# Altium project Universal Robot Board.PrjPcb
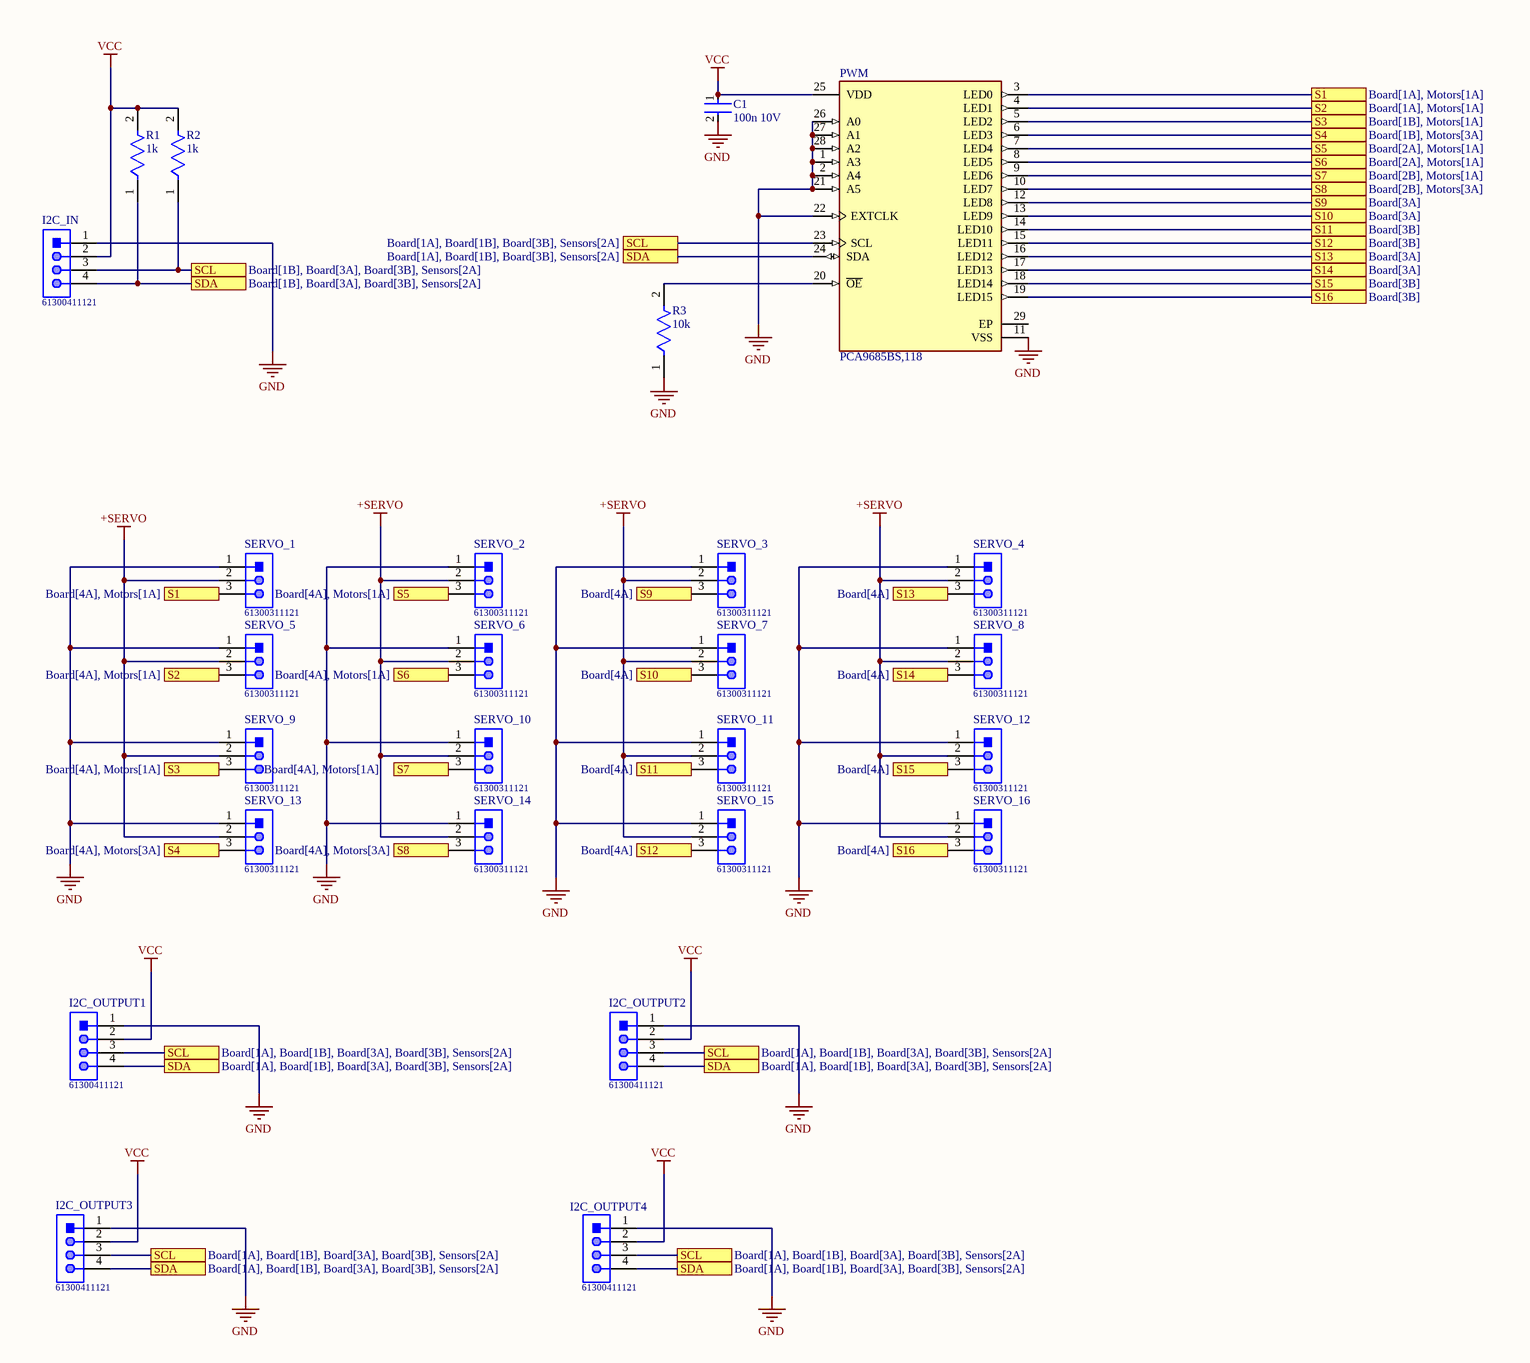
[diagram p0: Board.SchDoc]
4 sheets, 84 parts. Net scope: flat (ports and power ports of the same name join across sheets).
Board file: Board.PcbDoc
Sheets:
  Board.SchDoc
  Power.SchDoc
  Motors.SchDoc
  Sensors.SchDoc

## Sheet Board.SchDoc
size A1; SheetNumber: 1; SheetTotal: 4

### Parts
C1  100n 10V  [FP-GRM155-0_05-MFG]
I2C_IN  61300411121  [61300411121]
I2C_OUTPUT1  61300411121  [61300411121]
I2C_OUTPUT2  61300411121  [61300411121]
I2C_OUTPUT3  61300411121  [61300411121]
I2C_OUTPUT4  61300411121  [61300411121]
PWM  PCA9685BS,118  [FP-SOT788-1-IPC_B]
R1  1k  [FP-CRCW0402-e3-IPC_C]
R2  1k  [FP-CRCW0402-e3-IPC_C]
R3  10k  [FP-CRCW0402-e3-IPC_C]
SERVO_1  61300311121  [61300311121]
SERVO_2  61300311121  [61300311121]
SERVO_3  61300311121  [61300311121]
SERVO_4  61300311121  [61300311121]
SERVO_5  61300311121  [61300311121]
SERVO_6  61300311121  [61300311121]
SERVO_7  61300311121  [61300311121]
SERVO_8  61300311121  [61300311121]
SERVO_9  61300311121  [61300311121]
SERVO_10  61300311121  [61300311121]
SERVO_11  61300311121  [61300311121]
SERVO_12  61300311121  [61300311121]
SERVO_13  61300311121  [61300311121]
SERVO_14  61300311121  [61300311121]
SERVO_15  61300311121  [61300311121]
SERVO_16  61300311121  [61300311121]

### Ports
S1 (see Board[1A], Motors[1A]), S1 (see Board[4A], Motors[1A]), S2 (see Board[1A], Motors[1A]), S2 (see Board[4A], Motors[1A]), S3 (see Board[1B], Motors[1A]), S3 (see Board[4A], Motors[1A]), S4 (see Board[1B], Motors[3A]), S4 (see Board[4A], Motors[3A]), S5 (see Board[2A], Motors[1A]), S5 (see Board[4A], Motors[1A]), S6 (see Board[2A], Motors[1A]), S6 (see Board[4A], Motors[1A]), S7 (see Board[2B], Motors[1A]), S7 (see Board[4A], Motors[1A]), S8 (see Board[2B], Motors[3A]), S8 (see Board[4A], Motors[3A]), S9 (see Board[3A]), S9 (see Board[4A]), S10 (see Board[3A]), S10 (see Board[4A]), S11 (see Board[3B]), S11 (see Board[4A]), S12 (see Board[3B]), S12 (see Board[4A]), S13 (see Board[3A]), S13 (see Board[4A]), S14 (see Board[3A]), S14 (see Board[4A]), S15 (see Board[3B]), S15 (see Board[4A]), S16 (see Board[3B]), S16 (see Board[4A]), SCL (see Board[1A], Board[1B], Board[3A], Board[3B], Sensors[2A]), SCL (see Board[1A], Board[1B], Board[3B], Sensors[2A]), SCL (see Board[1B], Board[3A], Board[3B], Sensors[2A]), SDA (see Board[1A], Board[1B], Board[3A], Board[3B], Sensors[2A]), SDA (see Board[1A], Board[1B], Board[3B], Sensors[2A]), SDA (see Board[1B], Board[3A], Board[3B], Sensors[2A])

### Nets
+SERVO: SERVO_1.2 SERVO_2.2 SERVO_3.2 SERVO_4.2 SERVO_5.2 SERVO_6.2 SERVO_7.2 SERVO_8.2 SERVO_9.2 SERVO_10.2 SERVO_11.2 SERVO_12.2 SERVO_13.2 SERVO_14.2 SERVO_15.2 SERVO_16.2
GND: C1.2 I2C_IN.1 I2C_OUTPUT1.1 I2C_OUTPUT2.1 I2C_OUTPUT3.1 I2C_OUTPUT4.1 PWM.1(A3) PWM.2(A4) PWM.11(VSS) PWM.21(A5) PWM.22(EXTCLK) PWM.26(A0) PWM.27(A1) PWM.28(A2) R3.1 SERVO_1.1 SERVO_2.1 SERVO_3.1 SERVO_4.1 SERVO_5.1 SERVO_6.1 SERVO_7.1 SERVO_8.1 SERVO_9.1 SERVO_10.1 SERVO_11.1 SERVO_12.1 SERVO_13.1 SERVO_14.1 SERVO_15.1 SERVO_16.1
VCC: C1.1 I2C_IN.2 I2C_OUTPUT1.2 I2C_OUTPUT2.2 I2C_OUTPUT3.2 I2C_OUTPUT4.2 PWM.25(VDD) R1.2 R2.2
NetI2C_IN_3: I2C_IN.3 I2C_OUTPUT1.3 I2C_OUTPUT2.3 I2C_OUTPUT3.3 I2C_OUTPUT4.3 PWM.23(SCL) R2.1 ; port SCL
NetI2C_IN_4: I2C_IN.4 I2C_OUTPUT1.4 I2C_OUTPUT2.4 I2C_OUTPUT3.4 I2C_OUTPUT4.4 PWM.24(SDA) R1.1 ; port SDA
NetMOTOR_A1_1: PWM.7(LED4) SERVO_2.3 ; port S5
NetMOTOR_A1_2: PWM.8(LED5) SERVO_6.3 ; port S6
NetMOTOR_A1_3: PWM.9(LED6) SERVO_10.3 ; port S7
NetMOTOR_A1_16: PWM.10(LED7) SERVO_14.3 ; port S8
NetMOTOR_B1_1: PWM.4(LED1) SERVO_5.3 ; port S2
NetMOTOR_B1_2: PWM.5(LED2) SERVO_9.3 ; port S3
NetMOTOR_B1_3: PWM.6(LED3) SERVO_13.3 ; port S4
NetMOTOR_B1_16: PWM.3(LED0) SERVO_1.3 ; port S1
NetPWM_12: PWM.12(LED8) SERVO_3.3 ; port S9
NetPWM_13: PWM.13(LED9) SERVO_7.3 ; port S10
NetPWM_14: PWM.14(LED10) SERVO_11.3 ; port S11
NetPWM_15: PWM.15(LED11) SERVO_15.3 ; port S12
NetPWM_16: PWM.16(LED12) SERVO_4.3 ; port S13
NetPWM_17: PWM.17(LED13) SERVO_8.3 ; port S14
NetPWM_18: PWM.18(LED14) SERVO_12.3 ; port S15
NetPWM_19: PWM.19(LED15) SERVO_16.3 ; port S16
NetPWM_20: PWM.20(~{OE}) R3.2

Not connected (* = marked no-connect by the designer): PWM 29(EP)

### Library data of the parts
C1 = CMP-2008-04345-2: Chip Multilayer Ceramic Capacitors for General Purpose, 0402, 390pF, C0G, 30ppm/°C, 5%, 50V; REACH SVHC: No SVHC; Case Code (Metric): 1005; Thickness: 0.022inch; Lead Free: Lead Free; Case/Package: 0402; Min Operating Temperature: -55°C; Mount: Surface Mount; Length: 1mm; Depth: 0.5mm; Package Quantity: 1; Tolerance: 5%; Case Code (Imperial): 0402; Temperature Coefficient: 30ppm/°C; Packaging: Tape and Reel; Voltage Rating (DC): 50V; Material: Ceramic; Voltage Rating: 50V; Max Operating Temperature: 125°C; Voltage: 50V; Radiation Hardening: No; Capacitance: 390pF; Termination: SMD/SMT; Height: 0.5mm; Dielectric: C0G; Width: 0.02inch
I2C_IN I2C_OUTPUT1-I2C_OUTPUT4 = CMP-1502-01064-1: THT Vertical Pin Header WR-PHD, Pitch 2.54 mm, Single Row, 4 pins; Manufacturer: Wurth Elektronik; Withstanding Voltage: 500VAC; Rated Current: 3A; Working Voltage: 250VAC; Pin Number: 4; Gender: Male; Contact Resistance: 20mOhm; Pitch: 2.54mm; Manufacturer URL: http://www.we-online.de; Operating Temperature: -40to105degC; Packaging: Bag; Mounting Technology: THT; Package Reference: 61300411121; Datasheet URL: https://katalog.we-online.de/em/datasheet/6130xx11121.pdf; Publisher: WurthElektronik; Part Number: 61300411121; Row Number: Single; Orientation: Vertical
PWM = CMP-1595-00001-4: IC LED DRVR LIN DIM 25MA 28HVQFN; Number of Outputs: 16; Output Voltage: 5.5V; Frequency: 50MHz; Min Operating Temperature: -40°C; Package Quantity: 4000; Case/Package: VQFN; Number of Pins: 28; Contact Plating: Gold; Radiation Hardening: No; RoHS Compliant: Yes; Packaging: Tape and Reel; Mount: Surface Mount; Max Operating Temperature: 85°C
R1-R3 = CMP-2002-08122-2: RES Thick Film, 0Ω, 0.063W, 0402; Tolerance: 5%; Max Power Dissipation: 63mW; Voltage Rating: 50V; Temperature Coefficient: 100ppm/°C; Resistance: 0mR; Contact Plating: Tin; Height: 0.35mm; Radiation Hardening: No; Features: Automotive AEC-Q200; Composition: Thick Film; Width: 0.5mm; Weight: 2.3E-05oz; Termination: SMD/SMT; Packaging: Tape and Reel; Mount: Surface Mount; Case Code (Metric): 1005; Military Standard: Not; Min Operating Temperature: -55°C; Number of Terminations: 2; Package Quantity: 1; Case Code (Imperial): 0402; Depth: 0.5mm; Max Operating Temperature: 155°C; Case/Package: 0402; Power Rating: 63mW; Lead Free: Lead Free; Voltage Rating (DC): 50V; Length: 1mm
SERVO_1-SERVO_16 = CMP-1502-01062-1: THT Vertical Pin Header WR-PHD, Pitch 2.54 mm, Single Row, 3 pins; Manufacturer: Wurth Elektronik; Withstanding Voltage: 500VAC; Working Voltage: 250VAC; Rated Current: 3A; Pitch: 2.54mm; Pin Number: 3; Gender: Male; Contact Resistance: 20mOhm; Package Reference: 61300311121; Manufacturer URL: http://www.we-online.de; Datasheet URL: https://katalog.we-online.de/em/datasheet/6130xx11121.pdf; Operating Temperature: -40to105degC; Part Number: 61300311121; Orientation: Vertical; Packaging: Bag; Row Number: Single; Mounting Technology: THT; Publisher: WurthElektronik

## Sheet Power.SchDoc
size A1; SheetNumber: 2; SheetTotal: 4
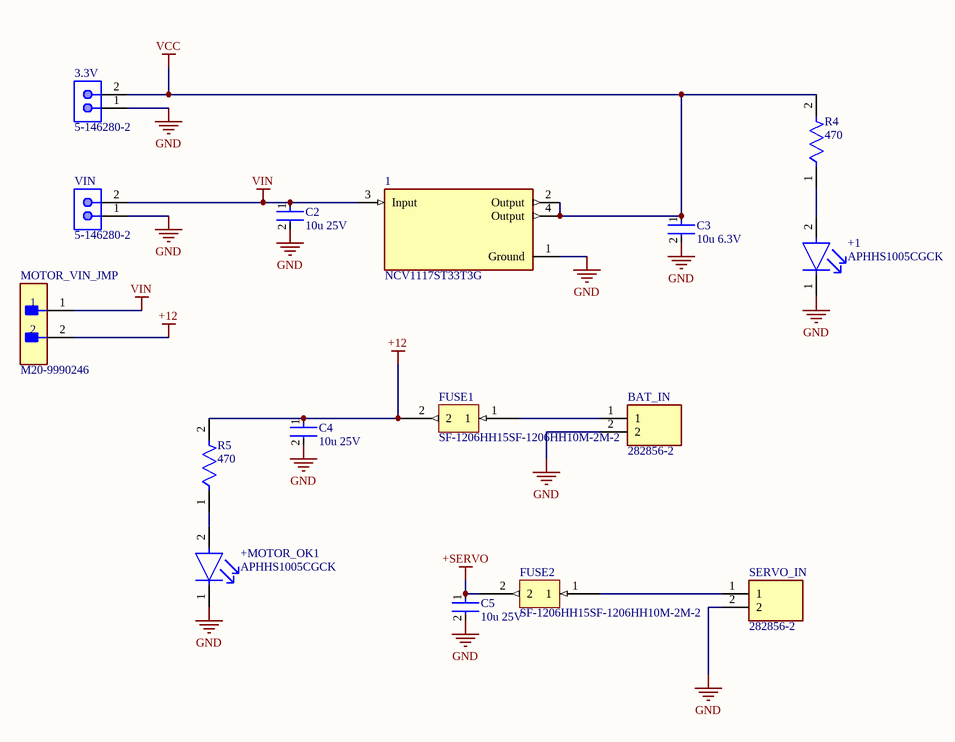
[diagram p1: Power.SchDoc]

### Parts
1  NCV1117ST33T3G  [FP-318H-MFG]
3.3V  5-146280-2  [TECO-5-146280-2_V]
+1  APHHS1005CGCK  [FP-APHHS1005CGCK-MFG]
+MOTOR_OK1  APHHS1005CGCK  [FP-APHHS1005CGCK-MFG]
BAT_IN  282856-2  [TE_282856-2]
C2  10u 25V  [FP-GRM21B-0_15-IPC_C]
C3  10u 6.3V  [FP-GRM155-0_05-MFG]
C4  10u 25V  [FP-GRM21B-0_15-IPC_C]
C5  10u 25V  [FP-GRM21B-0_15-IPC_C]
FUSE1  SF-1206HH15SF-1206HH10M-2M-2  [RESC3216X12N]
FUSE2  SF-1206HH15SF-1206HH10M-2M-2  [RESC3216X12N]
MOTOR_VIN_JMP  M20-9990246  [FP-M20-9990246-MFG]
R4  470  [FP-CRCW0402-e3-IPC_C]
R5  470  [FP-CRCW0402-e3-IPC_C]
SERVO_IN  282856-2  [TE_282856-2]
VIN  5-146280-2  [TECO-5-146280-2_V]

### Nets
+12: C4.1 FUSE1.2 MOTOR_VIN_JMP.2 R5.2
+SERVO: C5.1 FUSE2.2
GND: 1.1(Ground) 3.3V.1 +1.1(C) +MOTOR_OK1.1(C) BAT_IN.2 C2.2 C3.2 C4.2 C5.2 SERVO_IN.2 VIN.1
VCC: 1.2(Output) 1.4(Output) 3.3V.2 C3.1 R4.2
VIN: 1.3(Input) C2.1 MOTOR_VIN_JMP.1 VIN.2
Net+1_2: +1.2(A) R4.1
Net+MOTOR_OK1_2: +MOTOR_OK1.2(A) R5.1
NetBAT_IN_1: BAT_IN.1 FUSE1.1
NetFUSE2_1: FUSE2.1 SERVO_IN.1

### Library data of the parts
1 = CMP-07128-000021-1: IC REG LINEAR 3.3V 1A SOT223; Manufacturer: ON Semiconductor; Nominal Supply Current: 6mA; Min Supply Voltage: 2.4V; Number Of Outputs: 1; Standoff Height: 0.02mm; Automotive Grade: Grade 0; Accuracy Percentage: 1%; Max Junction Temp: +150°C; Output Type: Fixed; Dropout Voltage: 1.07V; Max Supply Voltage: 20V; Package: 318H; ComponentLink2Description: Datasheet; Output Current: 1A; Device Class L1: Integrated Circuits (ICs); Ambient Temperature Range Low: -40°C; Output Voltage: 3.3V; Octopart: https://octopart.com/ncv1117st33t3g-on+semiconductor-1215835; Manufacturer Part Number: NCV1117ST33T3G; Device Class L2: Power Management ICs; ComponentLink2URL: https://www.onsemi.com/pub/Collateral/NCP1117-D.PDF; Ipc Land Pattern Name: SOT230P700X180-4; Digikey Description: IC REG LINEAR 3.3V 1A SOT223; Height: 1.8mm; Ambient Temperature Range High: +125°C; Mouser Description: LDO Voltage Regulators 3.3V 1.0A Automotive; Category: IC; Temperature: -55°C to +150°C; Automotive: Yes; Temperature Range Low: -55°C; Temperature Range High: +150°C; Lead Free: Yes; Device Class L3: Voltage Regulators - Linear; RoHS: TRUE
3.3V VIN = CMP-2000-07492-1: Male Header, Pitch 2.54 mm, 1 x 2 Position, Height 8.21 mm, Tail Length 3.05 mm, -65 to 105 degC, RoHS, Bulk; Manufacturer: TE Connectivity; Mating Connector Lock: No(Without); Number of Positions: 2; Pitch: 2.54mm; PCB Mounting Orientation: Vertical; Keyed: No; Case\/Package: 100; Mating Post Length: 0.23inch; High Temperature Housing: Yes; Max Current Rating: 5A; PCB Thickness: 0.063inch; PCB Mount Retention: Without; Approvals: CSA; Current Rating: 3A; Radiation Hardening: No; Length: 4.67mm; Contact Mating Length: 0.23inch; Connector Type: Header; Number of Rows: 1; Termination Post Length: 0.12inch; Board Standoff: No(Without); Max Operating Temperature: 105degC; Contact Shape: Square; Selectively Loaded: No(Without); Gasket: No(Without); Number of Contacts: 2; Contact Gender: Male; Mating Alignment: No(Without); Manufacturer URL: http://www.te.com/; Datasheet URL: http://www.te.com/commerce/DocumentDelivery/DDEController?Action=showdoc&DocId=Customer+Drawing%7F146280%7FH1%7Fpdf%7FEnglish%7FENG_CD_146280_H1.pdf%7F5-146280-2; Mount: ThroughHole; Orientation: Straight; Packaging: Carton; Package Reference: 5-146280-2; Package Quantity: 500; Stabilizers: No(Without); Row Spacing: 2.54mm; Contact Material: CopperAlloy; Panel Mount Retention: No(Without); Datasheet Version: Rev. H1, 08/2016; Housing Colour: Black; Colour: Black; Package Description: Male Header, Pitch 2.54 mm, 1 x 2 Position, Height 8.21 mm, Tail Length 3.05 mm; Contact Plating: Matte; Housing Material: Polymer; Contact Protection: No(Without); Min Operating Temperature: -65degC; Mounting Technology: ThroughHole; Flammability Rating: UL94V-0; RoHSCompliant: true; Termination: ThroughHole; Depth: 2.34mm; High Speed Serial Data Connector: No
+1 +MOTOR_OK1 = CMP-44529-000044-1: LED GREEN CLEAR CHIP SMD; Viewing Angle: 120°; Dominant Wavelength: 570nm; Test Current: 20mA; Luminous Intensity: 50mcd; Forward Voltage: 2.1V; Number of LEDs: 1; Lens Color: Clear; Packaging: Tape and Reel; Max Operating Temperature: 85°C; Illumination Color: Green; Length: 1mm; Mount: Surface Mount; Lens Style: Clear; Color: Green; Number of Pins: 2; Wavelength: 570nm; Case/Package: 0402; Width: 0.5mm; Package Quantity: 2000; Case Code (Metric): 1005; Height: 0.6mm; Lead Free: Lead Free; Case Code (Imperial): 0402; Forward Current: 20mA; Min Operating Temperature: -40°C
BAT_IN SERVO_IN = CMP-036-000000-1: TERMI-BLOK PCB MOUNT 2P; MF: TE Connectivity; Design Item ID: 282856-2; Component Type: Standard; Package: None; Value: *; EU_RoHS_Compliance: Compliant with Exemptions; SnapEDA_Link: https://www.snapeda.com/parts/282856-2/TE%20Connectivity%20AMP%20Connectors/view-part/1809079/?ref=snap; Digi-Key_Purchase_URL: https://www.digikey.com/product-detail/en/te-connectivity-amp-connectors/1-282856-2/A98108-ND/1826971?utm_source=snapeda&utm_medium=aggregator&utm_campaign=symbol; Digi-Key_Part_Number: A98108-ND; TE_purchase_URL: https://www.te.com/usa-en/product-282856-2.html?te_bu=Cor&te_type=disp&te_campaign=seda_glo_cor-seda-global-disp-prtnr-fy19-seda-model-bom-cta_sma-317_1&elqCampaignId=32493; Pin Count: 2; MP: 282856-2; Source: SnapEDAsch.SchLib
C2 C4 C5 = CMP-2007-03541-2: Chip Multilayer Ceramic Capacitors for General Purpose, 0805, 10uF, X5R, 15%, 10%, 25V; Length: 2mm; Depth: 1.25mm; Termination: SMD/SMT; Voltage: 25V; Height: 1.25mm; Material: Ceramic; Thickness: 0.053inch; Radiation Hardening: No; Min Operating Temperature: -55°C; Width: 0.049inch; Package Quantity: 1; Mount: Surface Mount; Dielectric: X5R; Packaging: Tape and Reel; Capacitance: 10uF; Voltage Rating (DC): 25V; Lead Free: Lead Free; Max Operating Temperature: 85°C; Case Code (Imperial): 0805; Case/Package: 0805; Tolerance: 10%; Voltage Rating: 25V; Case Code (Metric): 2012
C3 = CMP-2008-04345-2: as C1 on sheet Board; REACH SVHC: No SVHC; Case Code (Metric): 1005; Thickness: 0.022inch; Lead Free: Lead Free; Case/Package: 0402; Min Operating Temperature: -55°C; Mount: Surface Mount; Length: 1mm; Depth: 0.5mm; Package Quantity: 1; Tolerance: 5%; Case Code (Imperial): 0402; Temperature Coefficient: 30ppm/°C; Packaging: Tape and Reel; Voltage Rating (DC): 50V; Material: Ceramic; Voltage Rating: 50V; Max Operating Temperature: 125°C; Voltage: 50V; Radiation Hardening: No; Capacitance: 390pF; Termination: SMD/SMT; Height: 0.5mm; Dielectric: C0G; Width: 0.02inch
FUSE1 FUSE2 = CMP-005-00013-1: Fuse Chip 10A 24VDC High Current and High Inrush Current Withstand 2-Pin SMD T/R
MOTOR_VIN_JMP = CMP-15831-000009-1: CONN HEADER VERT 2POS 2.54MM; Manufacturer: Harwin; Conn Gender: Male; Conn Orientation: Vertical; Number Of Contacts: 2; Current Rating: 3A; ComponentLink2URL: https://cdn.harwin.com/pdfs/M20-999.pdf; ComponentLink2Description: Datasheet; Package: M20-9990246; Temperature: -40°C to +105°C; Octopart: https://octopart.com/m20-9990246-harwin-2590635; Mouser Description: 2.54mm (0.1") Pitch SIL Vertical PC Tail Pin Header, 6.1mm mating pin height, tin, 2 contacts; Temperature Range High: +105°C; Device Class L1: Connectors; RoHS: TRUE; Automotive: No; Height: 8.99mm; Number Of Rows: 1; Contact Material: Tin,Nickel; Category: Conn; Pitch: 2.54mm; Lead Free: Yes; Digikey Description: CONN HEADER VERT 2POS 2.54MM; Manufacturer Part Number: M20-9990246; Temperature Range Low: -40°C; Device Class L3: unset; Device Class L2: Headers and Wire Housings
R4 R5 = CMP-2002-08122-2: as R1 on sheet Board; Contact Plating: Tin; Height: 0.35mm; Radiation Hardening: No; Features: Automotive AEC-Q200; Composition: Thick Film; Width: 0.5mm; Weight: 2.3E-05oz; Termination: SMD/SMT; Packaging: Tape and Reel; Mount: Surface Mount; Case Code (Metric): 1005; Military Standard: Not; Min Operating Temperature: -55°C; Number of Terminations: 2; Package Quantity: 1; Case Code (Imperial): 0402; Depth: 0.5mm; Max Operating Temperature: 155°C; Case/Package: 0402; Power Rating: 63mW; Lead Free: Lead Free; Voltage Rating (DC): 50V; Length: 1mm

## Sheet Motors.SchDoc
size A1; SheetNumber: 3; SheetTotal: 4
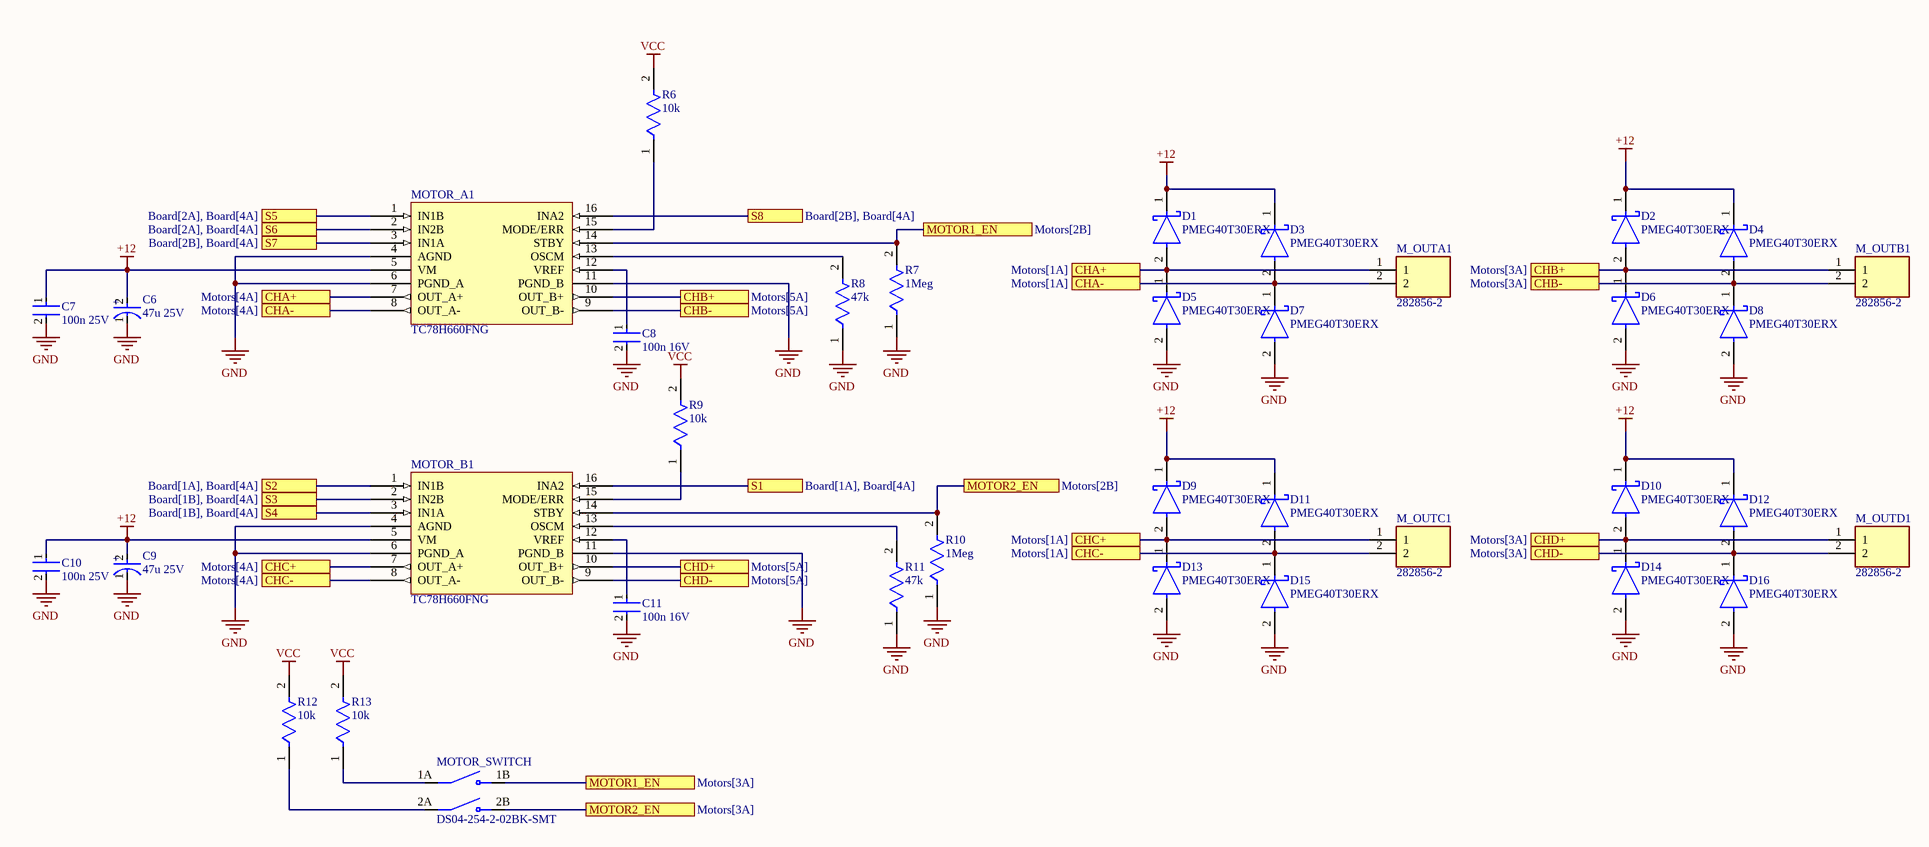
[diagram p2: Motors.SchDoc]

### Parts
C6  47u 25V  [FP-T491D476K025AT-MFG]
C7  100n 25V  [FP-C0402-BB-MFG]
C8  100n 16V  [FP-C0402-BB-MFG]
C9  47u 25V  [FP-T491D476K025AT-MFG]
C10  100n 25V  [FP-C0402-BB-MFG]
C11  100n 16V  [FP-C0402-BB-MFG]
D1  PMEG40T30ERX  [FP-SOD123-IPC_A]
D2  PMEG40T30ERX  [FP-SOD123-IPC_A]
D3  PMEG40T30ERX  [FP-SOD123-IPC_A]
D4  PMEG40T30ERX  [FP-SOD123-IPC_A]
D5  PMEG40T30ERX  [FP-SOD123-IPC_A]
D6  PMEG40T30ERX  [FP-SOD123-IPC_A]
D7  PMEG40T30ERX  [FP-SOD123-IPC_A]
D8  PMEG40T30ERX  [FP-SOD123-IPC_A]
D9  PMEG40T30ERX  [FP-SOD123-IPC_A]
D10  PMEG40T30ERX  [FP-SOD123-IPC_A]
D11  PMEG40T30ERX  [FP-SOD123-IPC_A]
D12  PMEG40T30ERX  [FP-SOD123-IPC_A]
D13  PMEG40T30ERX  [FP-SOD123-IPC_A]
D14  PMEG40T30ERX  [FP-SOD123-IPC_A]
D15  PMEG40T30ERX  [FP-SOD123-IPC_A]
D16  PMEG40T30ERX  [FP-SOD123-IPC_A]
M_OUTA1  282856-2  [TE_282856-2]
M_OUTB1  282856-2  [TE_282856-2]
M_OUTC1  282856-2  [TE_282856-2]
M_OUTD1  282856-2  [TE_282856-2]
MOTOR_A1  TC78H660FNG  [TSOP65P640X120-16N]
MOTOR_B1  TC78H660FNG  [TSOP65P640X120-16N]
MOTOR_SWITCH  DS04-254-2-02BK-SMT  [SW_DS04-254-2-02BK-SMT]
R6  10k  [FP-CRCW0402-e3-IPC_C]
R7  1Meg  [FP-CRCW0402-e3-IPC_C]
R8  47k  [FP-CRCW0402-e3-IPC_C]
R9  10k  [FP-CRCW0402-e3-IPC_C]
R10  1Meg  [FP-CRCW0402-e3-IPC_C]
R11  47k  [FP-CRCW0402-e3-IPC_C]
R12  10k  [FP-CRCW0402-e3-IPC_C]
R13  10k  [FP-CRCW0402-e3-IPC_C]

### Ports
CHA+ (see Motors[1A]), CHA+ (see Motors[4A]), CHA- (see Motors[1A]), CHA- (see Motors[4A]), CHB+ (see Motors[3A]), CHB+ (see Motors[5A]), CHB- (see Motors[3A]), CHB- (see Motors[5A]), CHC+ (see Motors[1A]), CHC+ (see Motors[4A]), CHC- (see Motors[1A]), CHC- (see Motors[4A]), CHD+ (see Motors[3A]), CHD+ (see Motors[5A]), CHD- (see Motors[3A]), CHD- (see Motors[5A]), MOTOR1_EN (see Motors[2B]), MOTOR1_EN (see Motors[3A]), MOTOR2_EN (see Motors[2B]), MOTOR2_EN (see Motors[3A]), S1 (see Board[1A], Board[4A]), S2 (see Board[1A], Board[4A]), S3 (see Board[1B], Board[4A]), S4 (see Board[1B], Board[4A]), S5 (see Board[2A], Board[4A]), S6 (see Board[2A], Board[4A]), S7 (see Board[2B], Board[4A]), S8 (see Board[2B], Board[4A])

### Nets
+12: C6.2(A) C7.1 C9.2(A) C10.1 D1.1(C) D2.1(C) D3.1(C) D4.1(C) D9.1(C) D10.1(C) D11.1(C) D12.1(C) MOTOR_A1.5(VM) MOTOR_B1.5(VM)
GND: C6.1(C) C7.2 C8.2 C9.1(C) C10.2 C11.2 D5.2(A) D6.2(A) D7.2(A) D8.2(A) D13.2(A) D14.2(A) D15.2(A) D16.2(A) MOTOR_A1.4(AGND) MOTOR_A1.6(PGND_A) MOTOR_A1.11(PGND_B) MOTOR_B1.4(AGND) MOTOR_B1.6(PGND_A) MOTOR_B1.11(PGND_B) R7.1 R8.1 R10.1 R11.1
VCC: R6.2 R9.2 R12.2 R13.2
NetC8_1: C8.1 MOTOR_A1.12(VREF)
NetC11_1: C11.1 MOTOR_B1.12(VREF)
NetD1_2: D1.2(A) D5.1(C) M_OUTA1.1 MOTOR_A1.7(OUT_A+) ; port CHA+
NetD2_2: D2.2(A) D6.1(C) M_OUTB1.1 MOTOR_A1.10(OUT_B+) ; port CHB+
NetD3_2: D3.2(A) D7.1(C) M_OUTA1.2 MOTOR_A1.8(OUT_A-) ; port CHA-
NetD4_2: D4.2(A) D8.1(C) M_OUTB1.2 MOTOR_A1.9(OUT_B-) ; port CHB-
NetD9_2: D9.2(A) D13.1(C) M_OUTC1.1 MOTOR_B1.7(OUT_A+) ; port CHC+
NetD10_2: D10.2(A) D14.1(C) M_OUTD1.1 MOTOR_B1.10(OUT_B+) ; port CHD+
NetD11_2: D11.2(A) D15.1(C) M_OUTC1.2 MOTOR_B1.8(OUT_A-) ; port CHC-
NetD12_2: D12.2(A) D16.1(C) M_OUTD1.2 MOTOR_B1.9(OUT_B-) ; port CHD-
NetMOTOR_A1_1: MOTOR_A1.1(IN1B) ; port S5
NetMOTOR_A1_2: MOTOR_A1.2(IN2B) ; port S6
NetMOTOR_A1_3: MOTOR_A1.3(IN1A) ; port S7
NetMOTOR_A1_13: MOTOR_A1.13(OSCM) R8.2
NetMOTOR_A1_14: MOTOR_A1.14(STBY) MOTOR_SWITCH.1B(NO1) R7.2 ; port MOTOR1_EN
NetMOTOR_A1_15: MOTOR_A1.15(MODE/ERR) R6.1
NetMOTOR_A1_16: MOTOR_A1.16(INA2) ; port S8
NetMOTOR_B1_1: MOTOR_B1.1(IN1B) ; port S2
NetMOTOR_B1_2: MOTOR_B1.2(IN2B) ; port S3
NetMOTOR_B1_3: MOTOR_B1.3(IN1A) ; port S4
NetMOTOR_B1_13: MOTOR_B1.13(OSCM) R11.2
NetMOTOR_B1_14: MOTOR_B1.14(STBY) MOTOR_SWITCH.2B(NO2) R10.2 ; port MOTOR2_EN
NetMOTOR_B1_15: MOTOR_B1.15(MODE/ERR) R9.1
NetMOTOR_B1_16: MOTOR_B1.16(INA2) ; port S1
NetMOTOR_SWITCH_1A: MOTOR_SWITCH.1A(COM1) R13.1
NetMOTOR_SWITCH_2A: MOTOR_SWITCH.2A(COM2) R12.1

### Notes on the sheet
- (in symbol CMP-03017-000020-1) +

### Library data of the parts
C6 C9 = CMP-03017-000020-1: CAP TANT 47UF 10% 25V 2917; Dielectric Material: Tantalum; Life (Hours): 2000Hour; Ripple Current: 463mA; Leakage Current: 11.8uA; Polarity: Polar; ESR (Equivalent Series Resistance): 700mR; Height - Seated (Max): 0.122inch; Package Quantity: 1; Max Operating Temperature: 125°C; Failure Rate: 0.001%; Height: 2.8mm; Voltage Rating (DC): 25V; Dissipation Factor: 10%; Mount: Surface Mount; Min Operating Temperature: -55°C; Packaging: Tape and Reel; Radiation Hardening: No; Case Code (Metric): 7343; Features: General Purpose; Voltage: 25V; Case/Package: 2917; Capacitance: 47uF; Case Code (Imperial): 2917; Tolerance: 10%; Number of Pins: 2; Weight: 0.023634oz; REACH SVHC: No SVHC; RoHS Compliant: Yes; Length: 7.3mm; Depth: 4.3mm; Lead Free: Lead Free; Width: 4.3mm; Voltage Rating: 25V; Termination: SMD/SMT
C7 C8 C10 C11 = CMP-2008-02108-2: CAP CER 0.1UF 16V X7R 0402; Manufacturer: Kemet; Manufacturer Part Number: C0402C104K4RACTU; Value: 0.10 μF; Tolerance: 0.1; Material: Ceramic; Temperature Coefficient: 15%; Voltage Rating: 16 V; Package: C0402-BB; Automotive: No; Ipc Land Pattern Name: CAPC10050X50; Device Class L3: Ceramic Capacitors; Capacitance: 0.10 μF; Octopart: https://octopart.com/c0402c104k4ractu-kemet-94158; Temperature Characteristic: X7R; Mouser Description: Cap Ceramic 0.1uF 16V X7R 10% SMD 0402 125?C Paper T/R - Tape and Reel (Alt: C0402C104K4RAC TU); ComponentLink2Description: Datasheet; Temperature Range Low: -55°C; RoHS: TRUE; Device Class L1: Passive Components; Temperature Range High: +125°C; Device Class L2: Capacitors; ComponentLink2URL: https://content.kemet.com/datasheets/KEM_C1002_X7R_SMD.pdf; Category: Cap; Height: 0.55mm; Temperature: -55°C to +125°C; Lead Free: Yes; Digikey Description: CAP CER 0.1UF 16V X7R 0402
D1-D16 = CMP-0303-00003-3: DIODE SCHOTTKY 40V 1A SOD123; Forward Voltage: 450mV; Capacitance: 110pF; Max Forward Surge Current (Ifsm): 25A; Peak Reverse Current: 50uA; Polarity: Standard; Element Configuration: Single; Max Power Dissipation: 450mW; Min Operating Temperature: -65°C; Package Quantity: 3000; Contact Plating: Tin; Weight: 0.000353oz; Max Repetitive Reverse Voltage (Vrrm): 40V; Max Reverse Voltage (DC): 40V; Height: 1.25mm; Average Rectified Current: 1A; Width: 1.7mm; Case/Package: SOD-123-2; Lead Free: Lead Free; Max Operating Temperature: 125°C; Current Rating: 1A; Termination: SMD/SMT; Forward Current: 1A; Radiation Hardening: No; Number of Pins: 2; Length: 2.85mm; Voltage Rating (DC): 40V; REACH SVHC: No SVHC; Peak Non-Repetitive Surge Current: 25A; Packaging: Tape and Reel; Output Current: 1A
M_OUTA1 M_OUTB1 M_OUTC1 M_OUTD1 = CMP-036-000000-1: as BAT_IN on sheet Power; Design Item ID: 282856-2; Component Type: Standard; Package: None; Value: *; EU_RoHS_Compliance: Compliant with Exemptions; SnapEDA_Link: https://www.snapeda.com/parts/282856-2/TE%20Connectivity%20AMP%20Connectors/view-part/1809079/?ref=snap; Digi-Key_Purchase_URL: https://www.digikey.com/product-detail/en/te-connectivity-amp-connectors/1-282856-2/A98108-ND/1826971?utm_source=snapeda&utm_medium=aggregator&utm_campaign=symbol; Digi-Key_Part_Number: A98108-ND; TE_purchase_URL: https://www.te.com/usa-en/product-282856-2.html?te_bu=Cor&te_type=disp&te_campaign=seda_glo_cor-seda-global-disp-prtnr-fy19-seda-model-bom-cta_sma-317_1&elqCampaignId=32493; Pin Count: 2; MP: 282856-2; Source: SnapEDAsch.SchLib
MOTOR_A1 MOTOR_B1 = CMP-024-00000-1: Toshiba two channel dc motor driver , 2A for each channel.
MOTOR_SWITCH = CMP-038-000000-1: 2 Position, Surface Mount, 2.54 mm Pitch, Flat Slide Actuator, Flat Bottom, SMT Pin, DIP Switch; MF: CUI Devices; Value: *; SnapEDA_Link: https://www.snapeda.com/parts/DS04-254-2-02BK-SMT/CUI+Devices/view-part/?ref=snap; Digi-Key_Part_Number: 2223-DS04-254-2-02BK-SMT-ND; CUI_purchase_URL: https://www.cuidevices.com/product/switches/dip-switches/ds04-254-smt-series?utm_source=snapeda.com&utm_medium=referral&utm_campaign=snapedaBOM; Package: None; Purchase-URL: https://pricing.snapeda.com/search/part/DS04-254-2-02BK-SMT/?ref=eda; MP: DS04-254-2-02BK-SMT; Source: DS04-254-2-02BK-SMT.SchLib; Pin Count: 4; Design Item ID: DS04-254-2-02BK-SMT; Component Type: Standard; Check_prices: https://www.snapeda.com/parts/DS04-254-2-02BK-SMT/CUI+Devices/view-part/?ref=eda
R6-R13 = CMP-2002-08122-2: as R1 on sheet Board; Contact Plating: Tin; Height: 0.35mm; Radiation Hardening: No; Features: Automotive AEC-Q200; Composition: Thick Film; Width: 0.5mm; Weight: 2.3E-05oz; Termination: SMD/SMT; Packaging: Tape and Reel; Mount: Surface Mount; Case Code (Metric): 1005; Military Standard: Not; Min Operating Temperature: -55°C; Number of Terminations: 2; Package Quantity: 1; Case Code (Imperial): 0402; Depth: 0.5mm; Max Operating Temperature: 155°C; Case/Package: 0402; Power Rating: 63mW; Lead Free: Lead Free; Voltage Rating (DC): 50V; Length: 1mm

## Sheet Sensors.SchDoc
size A1; SheetNumber: 4; SheetTotal: 4
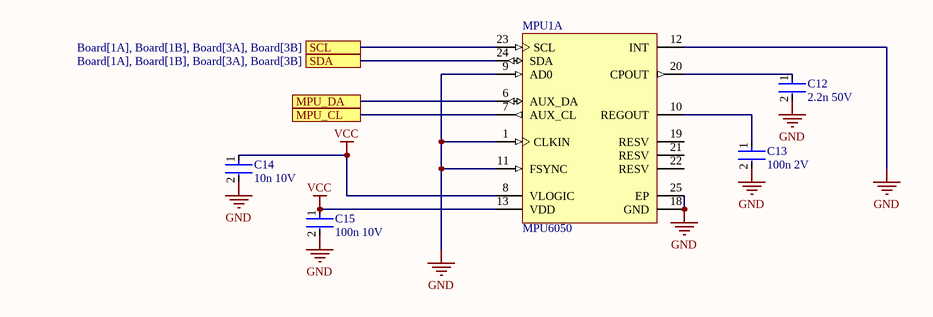
[diagram p3: Sensors.SchDoc]

### Parts
C12  2.2n 50V  [FP-GRM155-0_05-MFG]
C13  100n 2V  [FP-GRM155-0_05-MFG]
C14  10n 10V  [FP-GRM155-0_05-MFG]
C15  100n 10V  [FP-GRM155-0_05-MFG]
MPU1  MPU6050  [INSE-QFN-24_V]  (part A of 2)

### Ports
MPU_CL, MPU_DA, SCL (see Board[1A], Board[1B], Board[3A], Board[3B]), SDA (see Board[1A], Board[1B], Board[3A], Board[3B])

### Nets
GND: C12.2 C13.2 C14.2 C15.2 MPU1.1(CLKIN) MPU1.9(AD0) MPU1.11(FSYNC) MPU1.12(INT) MPU1.18(GND) MPU1.25(EP)
VCC: C14.1 C15.1 MPU1.8(VLOGIC) MPU1.13(VDD)
NetC12_1: C12.1 MPU1.20(CPOUT)
NetC13_1: C13.1 MPU1.10(REGOUT)
NetI2C_IN_3: MPU1.23(SCL) ; port SCL
NetI2C_IN_4: MPU1.24(SDA) ; port SDA
NetMPU1_6: MPU1.6(AUX_DA) ; port MPU_DA
NetMPU1_7: MPU1.7(AUX_CL) ; port MPU_CL

Not connected (* = marked no-connect by the designer): MPU1 19(RESV) 21(RESV) 22(RESV)

### Library data of the parts
C12-C15 = CMP-2008-04345-2: as C1 on sheet Board; REACH SVHC: No SVHC; Case Code (Metric): 1005; Thickness: 0.022inch; Lead Free: Lead Free; Case/Package: 0402; Min Operating Temperature: -55°C; Mount: Surface Mount; Length: 1mm; Depth: 0.5mm; Package Quantity: 1; Tolerance: 5%; Case Code (Imperial): 0402; Temperature Coefficient: 30ppm/°C; Packaging: Tape and Reel; Voltage Rating (DC): 50V; Material: Ceramic; Voltage Rating: 50V; Max Operating Temperature: 125°C; Voltage: 50V; Radiation Hardening: No; Capacitance: 390pF; Termination: SMD/SMT; Height: 0.5mm; Dielectric: C0G; Width: 0.02inch
MPU1 = CMP-010-00014-3: 3-Axis Gyroscope, 3-Axis Accelerometer, 2.375 to 3.46 V, -40 to 105 degC, 24-Pin QFN, RoHS, Tape and Reel; Manufacturer: InvenSense; Max Supply Voltage: 3.6V; Min Supply Voltage: 2.5V; Sensor Type: Motion; Interface: I2C; Min Operating Temperature: -40°C; Case/Package: QFN; Package Quantity: 5000; Pins: 24; RoHS Compliant: True; Packaging: CutTape; Datasheet URL: https://datasheet.ciiva.com/1513/1788002-1513632.pdf; Package Reference: QFN-24; Datasheet Version: Rev. 3.4, 08/2013; Package Description: 24-Pin Quad Flat No-lead Package, Body 4 x 4 mm, Pitch 0.5 mm; Max Operating Temperature: 85°C; Mounting Technology: SM

## Nets that join several sheets
+12: Power (C4.1 FUSE1.2 MOTOR_VIN_JMP.2 R5.2), Motors (14 pins)
+SERVO: Board (16 pins), Power (C5.1 FUSE2.2)
GND: Board (31 pins), Power (11 pins), Motors (24 pins), Sensors (10 pins)
VCC: Board (9 pins), Power (5 pins), Motors (R6.2 R9.2 R12.2 R13.2), Sensors (C14.1 C15.1 MPU1.8 MPU1.13)
NetI2C_IN_3: Board (7 pins), Sensors (MPU1.23)
NetI2C_IN_4: Board (7 pins), Sensors (MPU1.24)
NetMOTOR_A1_1: Board (PWM.7 SERVO_2.3), Motors (MOTOR_A1.1)
NetMOTOR_A1_2: Board (PWM.8 SERVO_6.3), Motors (MOTOR_A1.2)
NetMOTOR_A1_3: Board (PWM.9 SERVO_10.3), Motors (MOTOR_A1.3)
NetMOTOR_A1_16: Board (PWM.10 SERVO_14.3), Motors (MOTOR_A1.16)
NetMOTOR_B1_1: Board (PWM.4 SERVO_5.3), Motors (MOTOR_B1.1)
NetMOTOR_B1_2: Board (PWM.5 SERVO_9.3), Motors (MOTOR_B1.2)
NetMOTOR_B1_3: Board (PWM.6 SERVO_13.3), Motors (MOTOR_B1.3)
NetMOTOR_B1_16: Board (PWM.3 SERVO_1.3), Motors (MOTOR_B1.16)